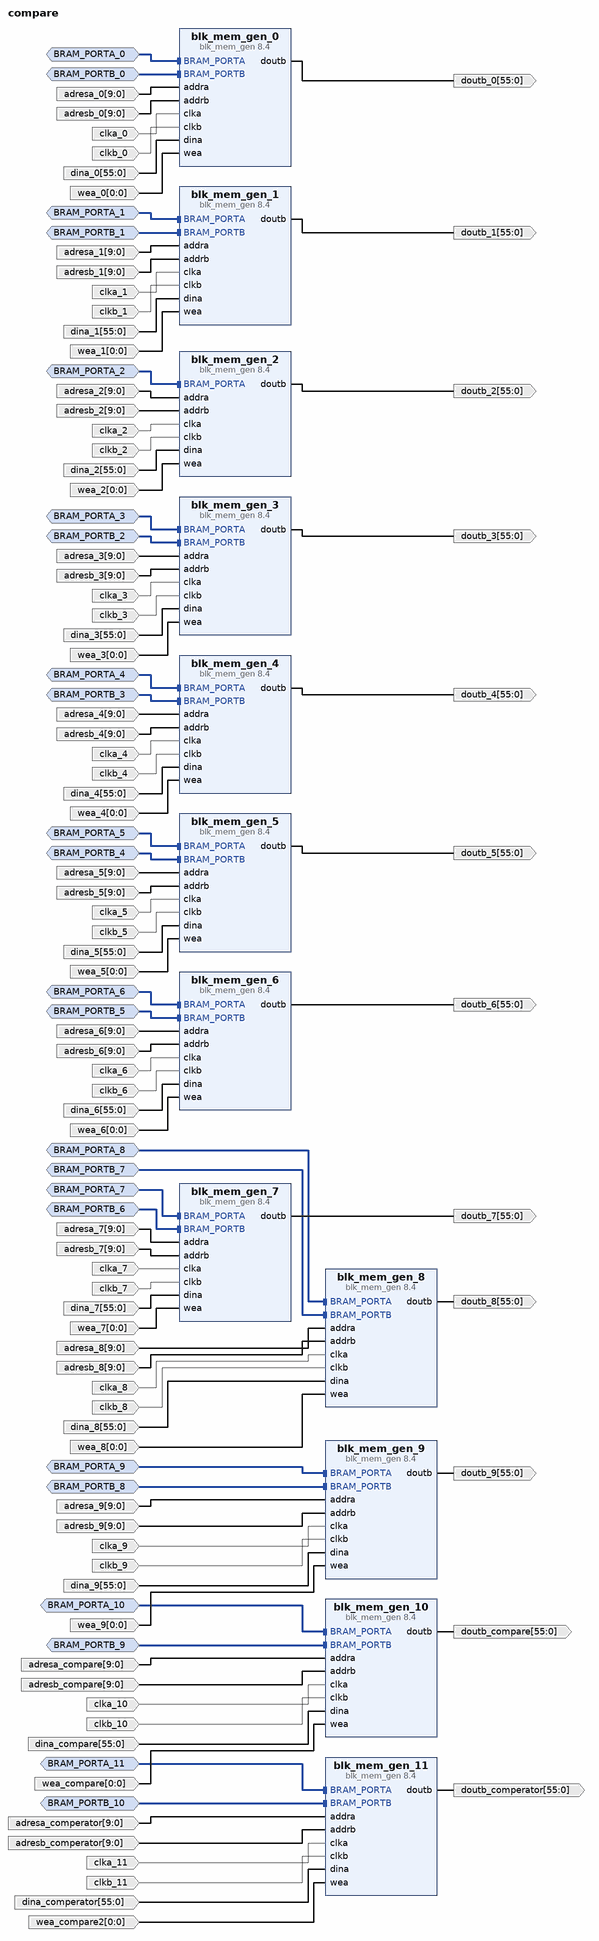
[diagram p0: block diagram of the top level]
# Vivado block design compare, xc7a35tcpg236-1, Vivado 2022.1
create_bd_design compare

create_bd_intf_port -mode Slave -vlnv xilinx.com:interface:bram_rtl:1.0 BRAM_PORTA_0
create_bd_intf_port -mode Slave -vlnv xilinx.com:interface:bram_rtl:1.0 BRAM_PORTB_0
create_bd_intf_port -mode Slave -vlnv xilinx.com:interface:bram_rtl:1.0 BRAM_PORTA_1
create_bd_intf_port -mode Slave -vlnv xilinx.com:interface:bram_rtl:1.0 BRAM_PORTB_1
create_bd_intf_port -mode Slave -vlnv xilinx.com:interface:bram_rtl:1.0 BRAM_PORTA_2
create_bd_intf_port -mode Slave -vlnv xilinx.com:interface:bram_rtl:1.0 BRAM_PORTA_3
create_bd_intf_port -mode Slave -vlnv xilinx.com:interface:bram_rtl:1.0 BRAM_PORTB_2
create_bd_intf_port -mode Slave -vlnv xilinx.com:interface:bram_rtl:1.0 BRAM_PORTA_4
create_bd_intf_port -mode Slave -vlnv xilinx.com:interface:bram_rtl:1.0 BRAM_PORTB_3
create_bd_intf_port -mode Slave -vlnv xilinx.com:interface:bram_rtl:1.0 BRAM_PORTA_5
create_bd_intf_port -mode Slave -vlnv xilinx.com:interface:bram_rtl:1.0 BRAM_PORTB_4
create_bd_intf_port -mode Slave -vlnv xilinx.com:interface:bram_rtl:1.0 BRAM_PORTA_6
create_bd_intf_port -mode Slave -vlnv xilinx.com:interface:bram_rtl:1.0 BRAM_PORTB_5
create_bd_intf_port -mode Slave -vlnv xilinx.com:interface:bram_rtl:1.0 BRAM_PORTA_7
create_bd_intf_port -mode Slave -vlnv xilinx.com:interface:bram_rtl:1.0 BRAM_PORTB_6
create_bd_intf_port -mode Slave -vlnv xilinx.com:interface:bram_rtl:1.0 BRAM_PORTA_8
create_bd_intf_port -mode Slave -vlnv xilinx.com:interface:bram_rtl:1.0 BRAM_PORTB_7
create_bd_intf_port -mode Slave -vlnv xilinx.com:interface:bram_rtl:1.0 BRAM_PORTA_9
create_bd_intf_port -mode Slave -vlnv xilinx.com:interface:bram_rtl:1.0 BRAM_PORTB_8
create_bd_intf_port -mode Slave -vlnv xilinx.com:interface:bram_rtl:1.0 BRAM_PORTA_10
create_bd_intf_port -mode Slave -vlnv xilinx.com:interface:bram_rtl:1.0 BRAM_PORTB_9
create_bd_intf_port -mode Slave -vlnv xilinx.com:interface:bram_rtl:1.0 BRAM_PORTA_11
create_bd_intf_port -mode Slave -vlnv xilinx.com:interface:bram_rtl:1.0 BRAM_PORTB_10
create_bd_port -dir I -from 9 -to 0 adresa_0
create_bd_port -dir I -type clk clka_0
create_bd_port -dir I -from 55 -to 0 dina_0
create_bd_port -dir I -from 0 -to 0 wea_0
create_bd_port -dir I -from 9 -to 0 adresb_0
create_bd_port -dir I -type clk clkb_0
create_bd_port -dir O -from 55 -to 0 doutb_0
create_bd_port -dir I -from 9 -to 0 adresa_1
create_bd_port -dir I -type clk clka_1
create_bd_port -dir I -from 55 -to 0 dina_1
create_bd_port -dir I -from 0 -to 0 wea_1
create_bd_port -dir I -from 9 -to 0 adresb_1
create_bd_port -dir I -type clk clkb_1
create_bd_port -dir O -from 55 -to 0 doutb_1
create_bd_port -dir I -from 9 -to 0 adresa_2
create_bd_port -dir I -type clk clka_2
create_bd_port -dir I -from 55 -to 0 dina_2
create_bd_port -dir I -from 0 -to 0 wea_2
create_bd_port -dir I -from 9 -to 0 adresb_2
create_bd_port -dir I -type clk clkb_2
create_bd_port -dir O -from 55 -to 0 doutb_2
create_bd_port -dir I -from 9 -to 0 adresa_3
create_bd_port -dir I -type clk clka_3
create_bd_port -dir I -from 55 -to 0 dina_3
create_bd_port -dir I -from 0 -to 0 wea_3
create_bd_port -dir I -from 9 -to 0 adresb_3
create_bd_port -dir I -type clk clkb_3
create_bd_port -dir O -from 55 -to 0 doutb_3
create_bd_port -dir I -from 9 -to 0 adresa_4
create_bd_port -dir I -type clk clka_4
create_bd_port -dir I -from 55 -to 0 dina_4
create_bd_port -dir I -from 0 -to 0 wea_4
create_bd_port -dir I -from 9 -to 0 adresb_4
create_bd_port -dir I -type clk clkb_4
create_bd_port -dir O -from 55 -to 0 doutb_4
create_bd_port -dir I -from 9 -to 0 adresa_5
create_bd_port -dir I -type clk clka_5
create_bd_port -dir I -from 55 -to 0 dina_5
create_bd_port -dir I -from 0 -to 0 wea_5
create_bd_port -dir I -from 9 -to 0 adresb_5
create_bd_port -dir I -type clk clkb_5
create_bd_port -dir O -from 55 -to 0 doutb_5
create_bd_port -dir I -from 9 -to 0 adresa_6
create_bd_port -dir I -type clk clka_6
create_bd_port -dir I -from 55 -to 0 dina_6
create_bd_port -dir I -from 0 -to 0 wea_6
create_bd_port -dir I -from 9 -to 0 adresb_6
create_bd_port -dir I -type clk clkb_6
create_bd_port -dir O -from 55 -to 0 doutb_6
create_bd_port -dir I -from 9 -to 0 adresa_7
create_bd_port -dir I -type clk clka_7
create_bd_port -dir I -from 55 -to 0 dina_7
create_bd_port -dir I -from 0 -to 0 wea_7
create_bd_port -dir I -from 9 -to 0 adresb_7
create_bd_port -dir I -type clk clkb_7
create_bd_port -dir O -from 55 -to 0 doutb_7
create_bd_port -dir I -from 9 -to 0 adresa_8
create_bd_port -dir I -type clk clka_8
create_bd_port -dir I -from 55 -to 0 dina_8
create_bd_port -dir I -from 0 -to 0 wea_8
create_bd_port -dir I -from 9 -to 0 adresb_8
create_bd_port -dir I -type clk clkb_8
create_bd_port -dir O -from 55 -to 0 doutb_8
create_bd_port -dir I -from 9 -to 0 adresa_9
create_bd_port -dir I -type clk clka_9
create_bd_port -dir I -from 55 -to 0 dina_9
create_bd_port -dir I -from 0 -to 0 wea_9
create_bd_port -dir I -from 9 -to 0 adresb_9
create_bd_port -dir I -type clk clkb_9
create_bd_port -dir O -from 55 -to 0 doutb_9
create_bd_port -dir I -from 9 -to 0 adresa_compare
create_bd_port -dir I -type clk clka_10
create_bd_port -dir I -from 55 -to 0 dina_compare
create_bd_port -dir I -from 0 -to 0 wea_compare
create_bd_port -dir I -from 9 -to 0 adresb_compare
create_bd_port -dir I -type clk clkb_10
create_bd_port -dir O -from 55 -to 0 doutb_compare
create_bd_port -dir I -from 9 -to 0 adresa_comperator
create_bd_port -dir I -type clk clka_11
create_bd_port -dir I -from 55 -to 0 dina_comperator
create_bd_port -dir I -from 0 -to 0 wea_compare2
create_bd_port -dir I -from 9 -to 0 adresb_comperator
create_bd_port -dir I -type clk clkb_11
create_bd_port -dir O -from 55 -to 0 doutb_comperator

create_bd_cell -type ip -vlnv xilinx.com:ip:blk_mem_gen:8.4 blk_mem_gen_0
set_property -dict [list \
  CONFIG.Enable_32bit_Address false \
  CONFIG.Enable_A Always_Enabled \
  CONFIG.Enable_B Always_Enabled \
  CONFIG.Memory_Type Simple_Dual_Port_RAM \
  CONFIG.Operating_Mode_A NO_CHANGE \
  CONFIG.Port_B_Clock 100 \
  CONFIG.Port_B_Enable_Rate 100 \
  CONFIG.Read_Width_B 56 \
  CONFIG.Register_PortB_Output_of_Memory_Primitives true \
  CONFIG.Use_Byte_Write_Enable false \
  CONFIG.Write_Depth_A 819 \
  CONFIG.Write_Width_A 56 \
  CONFIG.Write_Width_B 56 \
  CONFIG.use_bram_block Stand_Alone \
] [get_bd_cells blk_mem_gen_0]
create_bd_cell -type ip -vlnv xilinx.com:ip:blk_mem_gen:8.4 blk_mem_gen_1
set_property -dict [list \
  CONFIG.Enable_32bit_Address false \
  CONFIG.Enable_A Always_Enabled \
  CONFIG.Enable_B Always_Enabled \
  CONFIG.Memory_Type Simple_Dual_Port_RAM \
  CONFIG.Operating_Mode_A NO_CHANGE \
  CONFIG.Port_B_Clock 100 \
  CONFIG.Port_B_Enable_Rate 100 \
  CONFIG.Read_Width_B 56 \
  CONFIG.Register_PortB_Output_of_Memory_Primitives true \
  CONFIG.Use_Byte_Write_Enable false \
  CONFIG.Write_Depth_A 819 \
  CONFIG.Write_Width_A 56 \
  CONFIG.Write_Width_B 56 \
  CONFIG.use_bram_block Stand_Alone \
] [get_bd_cells blk_mem_gen_1]
create_bd_cell -type ip -vlnv xilinx.com:ip:blk_mem_gen:8.4 blk_mem_gen_2
set_property -dict [list \
  CONFIG.Enable_32bit_Address false \
  CONFIG.Enable_A Always_Enabled \
  CONFIG.Enable_B Always_Enabled \
  CONFIG.Memory_Type Simple_Dual_Port_RAM \
  CONFIG.Operating_Mode_A NO_CHANGE \
  CONFIG.Port_A_Write_Rate 50 \
  CONFIG.Port_B_Clock 100 \
  CONFIG.Port_B_Enable_Rate 100 \
  CONFIG.Read_Width_B 56 \
  CONFIG.Register_PortB_Output_of_Memory_Primitives true \
  CONFIG.Use_Byte_Write_Enable false \
  CONFIG.Write_Depth_A 819 \
  CONFIG.Write_Width_A 56 \
  CONFIG.Write_Width_B 56 \
  CONFIG.use_bram_block Stand_Alone \
] [get_bd_cells blk_mem_gen_2]
create_bd_cell -type ip -vlnv xilinx.com:ip:blk_mem_gen:8.4 blk_mem_gen_3
set_property -dict [list \
  CONFIG.Enable_32bit_Address false \
  CONFIG.Enable_A Always_Enabled \
  CONFIG.Enable_B Always_Enabled \
  CONFIG.Memory_Type Simple_Dual_Port_RAM \
  CONFIG.Operating_Mode_A NO_CHANGE \
  CONFIG.Port_B_Clock 100 \
  CONFIG.Port_B_Enable_Rate 100 \
  CONFIG.Read_Width_B 56 \
  CONFIG.Register_PortB_Output_of_Memory_Primitives true \
  CONFIG.Use_Byte_Write_Enable false \
  CONFIG.Write_Depth_A 819 \
  CONFIG.Write_Width_A 56 \
  CONFIG.Write_Width_B 56 \
  CONFIG.use_bram_block Stand_Alone \
] [get_bd_cells blk_mem_gen_3]
create_bd_cell -type ip -vlnv xilinx.com:ip:blk_mem_gen:8.4 blk_mem_gen_4
set_property -dict [list \
  CONFIG.Enable_32bit_Address false \
  CONFIG.Enable_A Always_Enabled \
  CONFIG.Enable_B Always_Enabled \
  CONFIG.Memory_Type Simple_Dual_Port_RAM \
  CONFIG.Operating_Mode_A NO_CHANGE \
  CONFIG.Port_B_Clock 100 \
  CONFIG.Port_B_Enable_Rate 100 \
  CONFIG.Read_Width_B 56 \
  CONFIG.Register_PortB_Output_of_Memory_Primitives true \
  CONFIG.Use_Byte_Write_Enable false \
  CONFIG.Write_Depth_A 819 \
  CONFIG.Write_Width_A 56 \
  CONFIG.Write_Width_B 56 \
  CONFIG.use_bram_block Stand_Alone \
] [get_bd_cells blk_mem_gen_4]
create_bd_cell -type ip -vlnv xilinx.com:ip:blk_mem_gen:8.4 blk_mem_gen_5
set_property -dict [list \
  CONFIG.Enable_32bit_Address false \
  CONFIG.Enable_A Always_Enabled \
  CONFIG.Enable_B Always_Enabled \
  CONFIG.Memory_Type Simple_Dual_Port_RAM \
  CONFIG.Operating_Mode_A NO_CHANGE \
  CONFIG.Port_B_Clock 100 \
  CONFIG.Port_B_Enable_Rate 100 \
  CONFIG.Read_Width_B 56 \
  CONFIG.Register_PortB_Output_of_Memory_Primitives true \
  CONFIG.Use_Byte_Write_Enable false \
  CONFIG.Write_Depth_A 819 \
  CONFIG.Write_Width_A 56 \
  CONFIG.Write_Width_B 56 \
  CONFIG.use_bram_block Stand_Alone \
] [get_bd_cells blk_mem_gen_5]
create_bd_cell -type ip -vlnv xilinx.com:ip:blk_mem_gen:8.4 blk_mem_gen_6
set_property -dict [list \
  CONFIG.Enable_32bit_Address false \
  CONFIG.Enable_A Always_Enabled \
  CONFIG.Enable_B Always_Enabled \
  CONFIG.Memory_Type Simple_Dual_Port_RAM \
  CONFIG.Operating_Mode_A NO_CHANGE \
  CONFIG.Port_A_Write_Rate 50 \
  CONFIG.Port_B_Clock 100 \
  CONFIG.Port_B_Enable_Rate 100 \
  CONFIG.Read_Width_B 56 \
  CONFIG.Register_PortB_Output_of_Memory_Primitives true \
  CONFIG.Use_Byte_Write_Enable false \
  CONFIG.Write_Depth_A 819 \
  CONFIG.Write_Width_A 56 \
  CONFIG.Write_Width_B 56 \
  CONFIG.use_bram_block Stand_Alone \
] [get_bd_cells blk_mem_gen_6]
create_bd_cell -type ip -vlnv xilinx.com:ip:blk_mem_gen:8.4 blk_mem_gen_7
set_property -dict [list \
  CONFIG.Enable_32bit_Address false \
  CONFIG.Enable_A Always_Enabled \
  CONFIG.Enable_B Always_Enabled \
  CONFIG.Memory_Type Simple_Dual_Port_RAM \
  CONFIG.Operating_Mode_A NO_CHANGE \
  CONFIG.Port_B_Clock 100 \
  CONFIG.Port_B_Enable_Rate 100 \
  CONFIG.Read_Width_B 56 \
  CONFIG.Register_PortB_Output_of_Memory_Primitives true \
  CONFIG.Use_Byte_Write_Enable false \
  CONFIG.Write_Depth_A 819 \
  CONFIG.Write_Width_A 56 \
  CONFIG.Write_Width_B 56 \
  CONFIG.use_bram_block Stand_Alone \
] [get_bd_cells blk_mem_gen_7]
create_bd_cell -type ip -vlnv xilinx.com:ip:blk_mem_gen:8.4 blk_mem_gen_8
set_property -dict [list \
  CONFIG.Enable_32bit_Address false \
  CONFIG.Enable_A Always_Enabled \
  CONFIG.Enable_B Always_Enabled \
  CONFIG.Memory_Type Simple_Dual_Port_RAM \
  CONFIG.Operating_Mode_A NO_CHANGE \
  CONFIG.Port_B_Clock 100 \
  CONFIG.Port_B_Enable_Rate 100 \
  CONFIG.Read_Width_B 56 \
  CONFIG.Register_PortB_Output_of_Memory_Primitives true \
  CONFIG.Use_Byte_Write_Enable false \
  CONFIG.Write_Depth_A 819 \
  CONFIG.Write_Width_A 56 \
  CONFIG.Write_Width_B 56 \
  CONFIG.use_bram_block Stand_Alone \
] [get_bd_cells blk_mem_gen_8]
create_bd_cell -type ip -vlnv xilinx.com:ip:blk_mem_gen:8.4 blk_mem_gen_9
set_property -dict [list \
  CONFIG.Enable_32bit_Address false \
  CONFIG.Enable_A Always_Enabled \
  CONFIG.Enable_B Always_Enabled \
  CONFIG.Memory_Type Simple_Dual_Port_RAM \
  CONFIG.Operating_Mode_A NO_CHANGE \
  CONFIG.Port_B_Clock 100 \
  CONFIG.Port_B_Enable_Rate 100 \
  CONFIG.Read_Width_B 56 \
  CONFIG.Register_PortB_Output_of_Memory_Primitives true \
  CONFIG.Use_Byte_Write_Enable false \
  CONFIG.Write_Depth_A 819 \
  CONFIG.Write_Width_A 56 \
  CONFIG.Write_Width_B 56 \
  CONFIG.use_bram_block Stand_Alone \
] [get_bd_cells blk_mem_gen_9]
create_bd_cell -type ip -vlnv xilinx.com:ip:blk_mem_gen:8.4 blk_mem_gen_10
set_property -dict [list \
  CONFIG.Enable_32bit_Address false \
  CONFIG.Enable_A Always_Enabled \
  CONFIG.Enable_B Always_Enabled \
  CONFIG.Memory_Type Simple_Dual_Port_RAM \
  CONFIG.Operating_Mode_A NO_CHANGE \
  CONFIG.Port_B_Clock 100 \
  CONFIG.Port_B_Enable_Rate 100 \
  CONFIG.Read_Width_B 56 \
  CONFIG.Register_PortB_Output_of_Memory_Primitives true \
  CONFIG.Use_Byte_Write_Enable false \
  CONFIG.Write_Depth_A 819 \
  CONFIG.Write_Width_A 56 \
  CONFIG.Write_Width_B 56 \
  CONFIG.use_bram_block Stand_Alone \
] [get_bd_cells blk_mem_gen_10]
create_bd_cell -type ip -vlnv xilinx.com:ip:blk_mem_gen:8.4 blk_mem_gen_11
set_property -dict [list \
  CONFIG.Enable_32bit_Address false \
  CONFIG.Enable_A Always_Enabled \
  CONFIG.Enable_B Always_Enabled \
  CONFIG.Memory_Type Simple_Dual_Port_RAM \
  CONFIG.Operating_Mode_A NO_CHANGE \
  CONFIG.Port_B_Clock 100 \
  CONFIG.Port_B_Enable_Rate 100 \
  CONFIG.Read_Width_B 56 \
  CONFIG.Register_PortB_Output_of_Memory_Primitives true \
  CONFIG.Use_Byte_Write_Enable false \
  CONFIG.Write_Depth_A 819 \
  CONFIG.Write_Width_A 56 \
  CONFIG.Write_Width_B 56 \
  CONFIG.use_bram_block Stand_Alone \
] [get_bd_cells blk_mem_gen_11]

# ---- connections ----

connect_bd_intf_net -intf_net BRAM_PORTA_0_1 [get_bd_intf_ports BRAM_PORTA_0] [get_bd_intf_pins blk_mem_gen_0/BRAM_PORTA]
connect_bd_intf_net -intf_net BRAM_PORTA_10_1 [get_bd_intf_ports BRAM_PORTA_10] [get_bd_intf_pins blk_mem_gen_10/BRAM_PORTA]
connect_bd_intf_net -intf_net BRAM_PORTA_11_1 [get_bd_intf_ports BRAM_PORTA_11] [get_bd_intf_pins blk_mem_gen_11/BRAM_PORTA]
connect_bd_intf_net -intf_net BRAM_PORTA_1_1 [get_bd_intf_ports BRAM_PORTA_1] [get_bd_intf_pins blk_mem_gen_1/BRAM_PORTA]
connect_bd_intf_net -intf_net BRAM_PORTA_2_1 [get_bd_intf_ports BRAM_PORTA_2] [get_bd_intf_pins blk_mem_gen_2/BRAM_PORTA]
connect_bd_intf_net -intf_net BRAM_PORTA_3_1 [get_bd_intf_ports BRAM_PORTA_3] [get_bd_intf_pins blk_mem_gen_3/BRAM_PORTA]
connect_bd_intf_net -intf_net BRAM_PORTA_4_1 [get_bd_intf_ports BRAM_PORTA_4] [get_bd_intf_pins blk_mem_gen_4/BRAM_PORTA]
connect_bd_intf_net -intf_net BRAM_PORTA_5_1 [get_bd_intf_ports BRAM_PORTA_5] [get_bd_intf_pins blk_mem_gen_5/BRAM_PORTA]
connect_bd_intf_net -intf_net BRAM_PORTA_6_1 [get_bd_intf_ports BRAM_PORTA_6] [get_bd_intf_pins blk_mem_gen_6/BRAM_PORTA]
connect_bd_intf_net -intf_net BRAM_PORTA_7_1 [get_bd_intf_ports BRAM_PORTA_7] [get_bd_intf_pins blk_mem_gen_7/BRAM_PORTA]
connect_bd_intf_net -intf_net BRAM_PORTA_8_1 [get_bd_intf_ports BRAM_PORTA_8] [get_bd_intf_pins blk_mem_gen_8/BRAM_PORTA]
connect_bd_intf_net -intf_net BRAM_PORTA_9_1 [get_bd_intf_ports BRAM_PORTA_9] [get_bd_intf_pins blk_mem_gen_9/BRAM_PORTA]
connect_bd_intf_net -intf_net BRAM_PORTB_0_1 [get_bd_intf_ports BRAM_PORTB_0] [get_bd_intf_pins blk_mem_gen_0/BRAM_PORTB]
connect_bd_intf_net -intf_net BRAM_PORTB_10_1 [get_bd_intf_ports BRAM_PORTB_10] [get_bd_intf_pins blk_mem_gen_11/BRAM_PORTB]
connect_bd_intf_net -intf_net BRAM_PORTB_1_1 [get_bd_intf_ports BRAM_PORTB_1] [get_bd_intf_pins blk_mem_gen_1/BRAM_PORTB]
connect_bd_intf_net -intf_net BRAM_PORTB_2_1 [get_bd_intf_ports BRAM_PORTB_2] [get_bd_intf_pins blk_mem_gen_3/BRAM_PORTB]
connect_bd_intf_net -intf_net BRAM_PORTB_3_1 [get_bd_intf_ports BRAM_PORTB_3] [get_bd_intf_pins blk_mem_gen_4/BRAM_PORTB]
connect_bd_intf_net -intf_net BRAM_PORTB_4_1 [get_bd_intf_ports BRAM_PORTB_4] [get_bd_intf_pins blk_mem_gen_5/BRAM_PORTB]
connect_bd_intf_net -intf_net BRAM_PORTB_5_1 [get_bd_intf_ports BRAM_PORTB_5] [get_bd_intf_pins blk_mem_gen_6/BRAM_PORTB]
connect_bd_intf_net -intf_net BRAM_PORTB_6_1 [get_bd_intf_ports BRAM_PORTB_6] [get_bd_intf_pins blk_mem_gen_7/BRAM_PORTB]
connect_bd_intf_net -intf_net BRAM_PORTB_7_1 [get_bd_intf_ports BRAM_PORTB_7] [get_bd_intf_pins blk_mem_gen_8/BRAM_PORTB]
connect_bd_intf_net -intf_net BRAM_PORTB_8_1 [get_bd_intf_ports BRAM_PORTB_8] [get_bd_intf_pins blk_mem_gen_9/BRAM_PORTB]
connect_bd_intf_net -intf_net BRAM_PORTB_9_1 [get_bd_intf_ports BRAM_PORTB_9] [get_bd_intf_pins blk_mem_gen_10/BRAM_PORTB]
connect_bd_net -net addra_0_1 [get_bd_ports adresa_0] [get_bd_pins blk_mem_gen_0/addra]
connect_bd_net -net addra_0_2 [get_bd_ports adresa_comperator] [get_bd_pins blk_mem_gen_11/addra]
connect_bd_net -net addra_10_1 [get_bd_ports adresa_compare] [get_bd_pins blk_mem_gen_10/addra]
connect_bd_net -net addra_1_1 [get_bd_ports adresa_1] [get_bd_pins blk_mem_gen_1/addra]
connect_bd_net -net addra_2_1 [get_bd_ports adresa_2] [get_bd_pins blk_mem_gen_2/addra]
connect_bd_net -net addra_3_1 [get_bd_ports adresa_3] [get_bd_pins blk_mem_gen_3/addra]
connect_bd_net -net addra_4_1 [get_bd_ports adresa_4] [get_bd_pins blk_mem_gen_4/addra]
connect_bd_net -net addra_5_1 [get_bd_ports adresa_5] [get_bd_pins blk_mem_gen_5/addra]
connect_bd_net -net addra_6_1 [get_bd_ports adresa_6] [get_bd_pins blk_mem_gen_6/addra]
connect_bd_net -net addra_7_1 [get_bd_ports adresa_7] [get_bd_pins blk_mem_gen_7/addra]
connect_bd_net -net addra_8_1 [get_bd_ports adresa_8] [get_bd_pins blk_mem_gen_8/addra]
connect_bd_net -net addra_9_1 [get_bd_ports adresa_9] [get_bd_pins blk_mem_gen_9/addra]
connect_bd_net -net addrb_0_1 [get_bd_ports adresb_0] [get_bd_pins blk_mem_gen_0/addrb]
connect_bd_net -net addrb_0_2 [get_bd_ports adresb_comperator] [get_bd_pins blk_mem_gen_11/addrb]
connect_bd_net -net addrb_10_1 [get_bd_ports adresb_compare] [get_bd_pins blk_mem_gen_10/addrb]
connect_bd_net -net addrb_1_1 [get_bd_ports adresb_1] [get_bd_pins blk_mem_gen_1/addrb]
connect_bd_net -net addrb_2_1 [get_bd_ports adresb_2] [get_bd_pins blk_mem_gen_2/addrb]
connect_bd_net -net addrb_3_1 [get_bd_ports adresb_3] [get_bd_pins blk_mem_gen_3/addrb]
connect_bd_net -net addrb_4_1 [get_bd_ports adresb_4] [get_bd_pins blk_mem_gen_4/addrb]
connect_bd_net -net addrb_5_1 [get_bd_ports adresb_5] [get_bd_pins blk_mem_gen_5/addrb]
connect_bd_net -net addrb_6_1 [get_bd_ports adresb_6] [get_bd_pins blk_mem_gen_6/addrb]
connect_bd_net -net addrb_7_1 [get_bd_ports adresb_7] [get_bd_pins blk_mem_gen_7/addrb]
connect_bd_net -net addrb_8_1 [get_bd_ports adresb_8] [get_bd_pins blk_mem_gen_8/addrb]
connect_bd_net -net addrb_9_1 [get_bd_ports adresb_9] [get_bd_pins blk_mem_gen_9/addrb]
connect_bd_net [get_bd_pins blk_mem_gen_0/doutb] [get_bd_ports doutb_0]
connect_bd_net [get_bd_pins blk_mem_gen_10/doutb] [get_bd_ports doutb_compare]
connect_bd_net [get_bd_pins blk_mem_gen_11/doutb] [get_bd_ports doutb_comperator]
connect_bd_net [get_bd_pins blk_mem_gen_1/doutb] [get_bd_ports doutb_1]
connect_bd_net [get_bd_pins blk_mem_gen_2/doutb] [get_bd_ports doutb_2]
connect_bd_net [get_bd_pins blk_mem_gen_3/doutb] [get_bd_ports doutb_3]
connect_bd_net [get_bd_pins blk_mem_gen_4/doutb] [get_bd_ports doutb_4]
connect_bd_net [get_bd_pins blk_mem_gen_5/doutb] [get_bd_ports doutb_5]
connect_bd_net [get_bd_pins blk_mem_gen_6/doutb] [get_bd_ports doutb_6]
connect_bd_net [get_bd_pins blk_mem_gen_7/doutb] [get_bd_ports doutb_7]
connect_bd_net [get_bd_pins blk_mem_gen_8/doutb] [get_bd_ports doutb_8]
connect_bd_net [get_bd_pins blk_mem_gen_9/doutb] [get_bd_ports doutb_9]
connect_bd_net -net clka_0_1 [get_bd_ports clka_0] [get_bd_pins blk_mem_gen_0/clka]
connect_bd_net -net clka_10_1 [get_bd_ports clka_10] [get_bd_pins blk_mem_gen_10/clka]
connect_bd_net -net clka_11_1 [get_bd_ports clka_11] [get_bd_pins blk_mem_gen_11/clka]
connect_bd_net -net clka_1_1 [get_bd_ports clka_1] [get_bd_pins blk_mem_gen_1/clka]
connect_bd_net -net clka_2_1 [get_bd_ports clka_2] [get_bd_pins blk_mem_gen_2/clka]
connect_bd_net -net clka_3_1 [get_bd_ports clka_3] [get_bd_pins blk_mem_gen_3/clka]
connect_bd_net -net clka_4_1 [get_bd_ports clka_4] [get_bd_pins blk_mem_gen_4/clka]
connect_bd_net -net clka_5_1 [get_bd_ports clka_5] [get_bd_pins blk_mem_gen_5/clka]
connect_bd_net -net clka_6_1 [get_bd_ports clka_6] [get_bd_pins blk_mem_gen_6/clka]
connect_bd_net -net clka_7_1 [get_bd_ports clka_7] [get_bd_pins blk_mem_gen_7/clka]
connect_bd_net -net clka_8_1 [get_bd_ports clka_8] [get_bd_pins blk_mem_gen_8/clka]
connect_bd_net -net clka_9_1 [get_bd_ports clka_9] [get_bd_pins blk_mem_gen_9/clka]
connect_bd_net -net clkb_0_1 [get_bd_ports clkb_0] [get_bd_pins blk_mem_gen_0/clkb]
connect_bd_net -net clkb_10_1 [get_bd_ports clkb_10] [get_bd_pins blk_mem_gen_10/clkb]
connect_bd_net -net clkb_11_1 [get_bd_ports clkb_11] [get_bd_pins blk_mem_gen_11/clkb]
connect_bd_net -net clkb_1_1 [get_bd_ports clkb_1] [get_bd_pins blk_mem_gen_1/clkb]
connect_bd_net -net clkb_2_1 [get_bd_ports clkb_2] [get_bd_pins blk_mem_gen_2/clkb]
connect_bd_net -net clkb_3_1 [get_bd_ports clkb_3] [get_bd_pins blk_mem_gen_3/clkb]
connect_bd_net -net clkb_4_1 [get_bd_ports clkb_4] [get_bd_pins blk_mem_gen_4/clkb]
connect_bd_net -net clkb_5_1 [get_bd_ports clkb_5] [get_bd_pins blk_mem_gen_5/clkb]
connect_bd_net -net clkb_6_1 [get_bd_ports clkb_6] [get_bd_pins blk_mem_gen_6/clkb]
connect_bd_net -net clkb_7_1 [get_bd_ports clkb_7] [get_bd_pins blk_mem_gen_7/clkb]
connect_bd_net -net clkb_8_1 [get_bd_ports clkb_8] [get_bd_pins blk_mem_gen_8/clkb]
connect_bd_net -net clkb_9_1 [get_bd_ports clkb_9] [get_bd_pins blk_mem_gen_9/clkb]
connect_bd_net -net dina_0_1 [get_bd_ports dina_0] [get_bd_pins blk_mem_gen_0/dina]
connect_bd_net -net dina_10_1 [get_bd_ports dina_compare] [get_bd_pins blk_mem_gen_10/dina]
connect_bd_net -net dina_10_2 [get_bd_ports dina_comperator] [get_bd_pins blk_mem_gen_11/dina]
connect_bd_net -net dina_1_1 [get_bd_ports dina_1] [get_bd_pins blk_mem_gen_1/dina]
connect_bd_net -net dina_2_1 [get_bd_ports dina_2] [get_bd_pins blk_mem_gen_2/dina]
connect_bd_net -net dina_3_1 [get_bd_ports dina_3] [get_bd_pins blk_mem_gen_3/dina]
connect_bd_net -net dina_4_1 [get_bd_ports dina_4] [get_bd_pins blk_mem_gen_4/dina]
connect_bd_net -net dina_5_1 [get_bd_ports dina_5] [get_bd_pins blk_mem_gen_5/dina]
connect_bd_net -net dina_6_1 [get_bd_ports dina_6] [get_bd_pins blk_mem_gen_6/dina]
connect_bd_net -net dina_7_1 [get_bd_ports dina_7] [get_bd_pins blk_mem_gen_7/dina]
connect_bd_net -net dina_8_1 [get_bd_ports dina_8] [get_bd_pins blk_mem_gen_8/dina]
connect_bd_net -net dina_9_1 [get_bd_ports dina_9] [get_bd_pins blk_mem_gen_9/dina]
connect_bd_net -net wea_0_1 [get_bd_ports wea_0] [get_bd_pins blk_mem_gen_0/wea]
connect_bd_net -net wea_10_1 [get_bd_ports wea_compare] [get_bd_pins blk_mem_gen_10/wea]
connect_bd_net -net wea_10_2 [get_bd_ports wea_compare2] [get_bd_pins blk_mem_gen_11/wea]
connect_bd_net -net wea_1_1 [get_bd_ports wea_1] [get_bd_pins blk_mem_gen_1/wea]
connect_bd_net -net wea_2_1 [get_bd_ports wea_2] [get_bd_pins blk_mem_gen_2/wea]
connect_bd_net -net wea_3_1 [get_bd_ports wea_3] [get_bd_pins blk_mem_gen_3/wea]
connect_bd_net -net wea_4_1 [get_bd_ports wea_4] [get_bd_pins blk_mem_gen_4/wea]
connect_bd_net -net wea_5_1 [get_bd_ports wea_5] [get_bd_pins blk_mem_gen_5/wea]
connect_bd_net -net wea_6_1 [get_bd_ports wea_6] [get_bd_pins blk_mem_gen_6/wea]
connect_bd_net -net wea_7_1 [get_bd_ports wea_7] [get_bd_pins blk_mem_gen_7/wea]
connect_bd_net -net wea_8_1 [get_bd_ports wea_8] [get_bd_pins blk_mem_gen_8/wea]
connect_bd_net -net wea_9_1 [get_bd_ports wea_9] [get_bd_pins blk_mem_gen_9/wea]

validate_bd_design
save_bd_design
